# Altium project PCB_Project.PrjPcb (part 4 of 4)
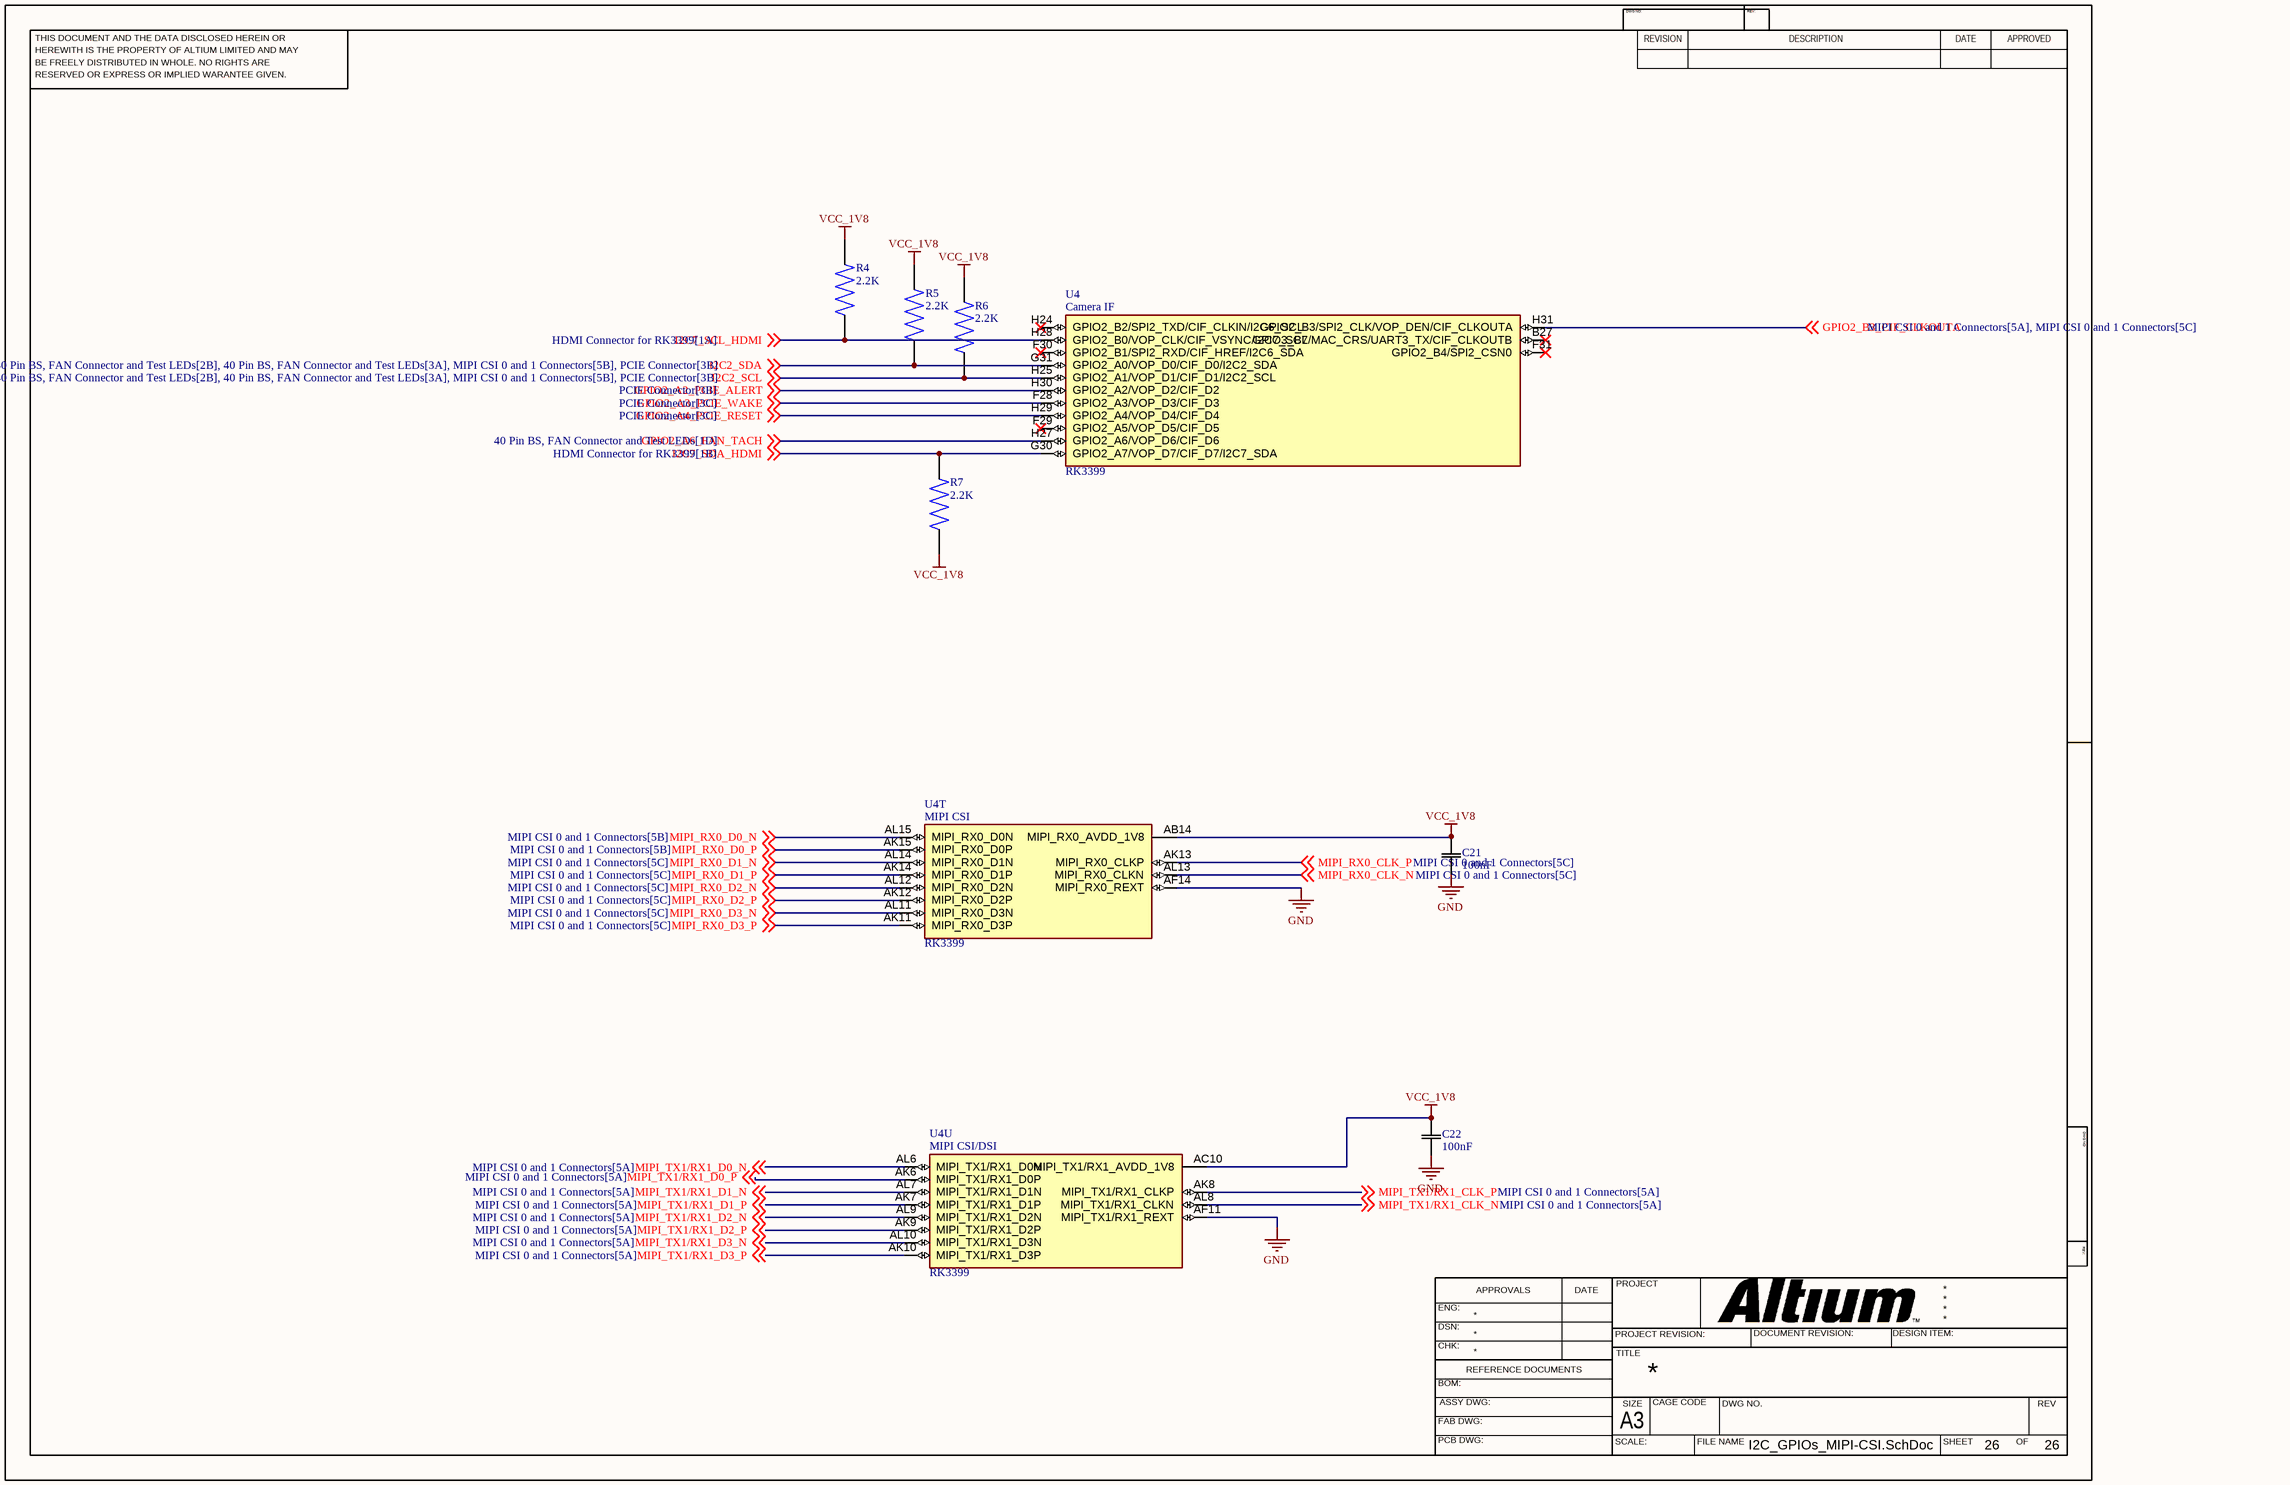
[diagram p26: I2C_GPIOs_MIPI-CSI.SchDoc]

## Nets that join several sheets
GND: USB2.0 (14 pins), TYPEC0 (24 pins), TYPEC (11 pins), System PMU for RK3399 (21 pins), SDMMC EMMC PCIE ADC Blocks (9 pins), RK3399 Side of LPDDR4 Controller (20 pins), Power Supply Page for RK3399 (214 pins), HDMI_MIPI-DSI_EDP (10 pins), HDMI Connector for RK3399 (14 pins), PMIC_Block_ (46 pins), LPDDR4 SDRAM_1 (77 pins), LPDDR4 SDRAM_2 (77 pins), EMMC with rk399 (10 pins), WIFI_MODULE (24 pins), SD Card and Debug Uart (18 pins), RGMII ETH PHY (B12.47 B12.49), RJ45 Connector and ESD Diodes (9 pins), Regulators and Buck Converters (28 pins), Power Supply for CPU Blocks (47 pins), MIPI CSI 0 and 1 Connectors (38 pins), EDP and MIPI DSI Connectors (21 pins), CODEC and Headphone Jack (20 pins), 40 Pin BS, FAN Connector and Test LEDs (16 pins), PCIE Connector (18 pins), I2C_GPIOs_MIPI-CSI (C21.1 C22.1 U4.AF11 U4.AF14)
VCC3V3_S3: EMMC with rk399 (5 pins), EDP and MIPI DSI Connectors (R93.1)
VCC3V3_S5: PMIC_Block_ (U7.51), Regulators and Buck Converters (C31.2 C224.2 U10.6 U11.6), Power Supply for CPU Blocks (Q4.2 Q4.3 R76.2)
VCC3V3_SYS: TYPEC0 (C13.2 U2.3 U2.4), System PMU for RK3399 (C12.1 U5.1), HDMI Connector for RK3399 (R38.2), WIFI_MODULE (B3.36 C205.2 C206.2 C218.2), SD Card and Debug Uart (C210.2 U9.1), Regulators and Buck Converters (C30.2 C241.1 C242.1 L6.2), Power Supply for CPU Blocks (20 pins), MIPI CSI 0 and 1 Connectors (8 pins), EDP and MIPI DSI Connectors (J11.17 J11.18), 40 Pin BS, FAN Connector and Test LEDs (C310.1 J14.1 J14.17), PCIE Connector (12 pins)
VCC5V0_HOST0: USB2.0 (8 pins), TYPEC0 (C32.2 U3.1)
VCC5V0_SYS: USB2.0 (C1.2 R1.2 U1.5), TYPEC0 (8 pins), HDMI Connector for RK3399 (F1.2 R35.2 R36.2), SD Card and Debug Uart (J7.2), Regulators and Buck Converters (C219.2 C251.1 C252.1 L7.2), MIPI CSI 0 and 1 Connectors (10 pins), EDP and MIPI DSI Connectors (J10.1 J10.2 J10.3), 40 Pin BS, FAN Connector and Test LEDs (C309.1 J14.2 J14.4)
VCC12V0_SYS: Regulators and Buck Converters (13 pins), EDP and MIPI DSI Connectors (J11.28 J11.29 J11.30), 40 Pin BS, FAN Connector and Test LEDs (R107.2)
VCC_0V9: TYPEC (10 pins), System PMU for RK3399 (6 pins), SDMMC EMMC PCIE ADC Blocks (C62.1 C64.1 U4.L24 U4.W24), RK3399 Side of LPDDR4 Controller (FL3.1 FL4.1), HDMI_MIPI-DSI_EDP (6 pins), Power Supply for CPU Blocks (C236.2 L10.2 R77.2)
VCC_1V8: TYPEC (6 pins), System PMU for RK3399 (23 pins), SDMMC EMMC PCIE ADC Blocks (C60.1 C66.1 U4.AC24 U4.K24), HDMI_MIPI-DSI_EDP (8 pins), EMMC with rk399 (5 pins), WIFI_MODULE (B3.34 C203.2 C204.2), Power Supply for CPU Blocks (5 pins), 40 Pin BS, FAN Connector and Test LEDs (J15.1 U21.3 U21.6), I2C_GPIOs_MIPI-CSI (8 pins)
VCC_3V0: RGMII_SDIO_I2S (8 pins), HDMI Connector for RK3399 (Q3.2 R37.2), PMIC_Block_ (C143.2 U7.15), SD Card and Debug Uart (R55.2 R56.2), CODEC and Headphone Jack (R104.2), 40 Pin BS, FAN Connector and Test LEDs (U21.7)
VCC_DDR: RK3399 Side of LPDDR4 Controller (46 pins), LPDDR4 SDRAM_1 (42 pins), LPDDR4 SDRAM_2 (42 pins)
VCC_DDRC: LPDDR4 SDRAM_1 (23 pins), LPDDR4 SDRAM_2 (23 pins)
VCC_LPDDR4_A: LPDDR4 SDRAM_1 (8 pins), LPDDR4 SDRAM_2 (8 pins)
VDD_GPU: Power Supply Page for RK3399 (30 pins), Power Supply for CPU Blocks (10 pins)
VDD_LOG: Power Supply Page for RK3399 (18 pins), Power Supply for CPU Blocks (C239.2 L11.2 R81.2)
ADC_IN0: SDMMC EMMC PCIE ADC Blocks (U4.AG26), 40 Pin BS, FAN Connector and Test LEDs (J16.2)
ADC_IN2: SDMMC EMMC PCIE ADC Blocks (U4.AG25), 40 Pin BS, FAN Connector and Test LEDs (J18.1)
ADC_IN3: SDMMC EMMC PCIE ADC Blocks (U4.AG28), 40 Pin BS, FAN Connector and Test LEDs (J18.2)
BT_REG_ON_H: System PMU for RK3399 (U4.V30), WIFI_MODULE (B3.38)
BT_WAKE_L: RGMII_SDIO_I2S (U4.AL4), WIFI_MODULE (B3.49)
CPU_B_SLEEP: RGMII_SDIO_I2S (U4.M27), Power Supply for CPU Blocks (U13.A1)
DDR0_A0: RK3399 Side of LPDDR4 Controller (U4.F2), LPDDR4 SDRAM_1 (B1.H2 B1.R2)
DDR0_A1: RK3399 Side of LPDDR4 Controller (U4.F1), LPDDR4 SDRAM_1 (B1.J2 B1.P2)
DDR0_A2: RK3399 Side of LPDDR4 Controller (U4.G1), LPDDR4 SDRAM_1 (B1.H9 B1.R9)
DDR0_A3: RK3399 Side of LPDDR4 Controller (U4.G2), LPDDR4 SDRAM_1 (B1.H10 B1.R10)
DDR0_A4: RK3399 Side of LPDDR4 Controller (U4.H2), LPDDR4 SDRAM_1 (B1.H11 B1.R11)
DDR0_A5: RK3399 Side of LPDDR4 Controller (U4.H1), LPDDR4 SDRAM_1 (B1.J11 B1.P11)
DDR0_CKE0: RK3399 Side of LPDDR4 Controller (U4.E1), LPDDR4 SDRAM_1 (B1.J4 B1.P4)
DDR0_CKE1: RK3399 Side of LPDDR4 Controller (U4.F5), LPDDR4 SDRAM_1 (B1.J5 B1.P5)
DDR0_CLK1_N: RK3399 Side of LPDDR4 Controller (U4.J5), LPDDR4 SDRAM_1 (B1.P9)
DDR0_CLK1_P: RK3399 Side of LPDDR4 Controller (U4.H5), LPDDR4 SDRAM_1 (B1.P8)
DDR0_CLK_N: RK3399 Side of LPDDR4 Controller (U4.J4), LPDDR4 SDRAM_1 (B1.J9)
DDR0_CLK_P: RK3399 Side of LPDDR4 Controller (U4.H4), LPDDR4 SDRAM_1 (B1.J8)
DDR0_CS0N: RK3399 Side of LPDDR4 Controller (U4.M6), LPDDR4 SDRAM_1 (B1.H4)
DDR0_CS1N: RK3399 Side of LPDDR4 Controller (U4.B1), LPDDR4 SDRAM_1 (B1.H3)
DDR0_CS2N: RK3399 Side of LPDDR4 Controller (U4.M5), LPDDR4 SDRAM_1 (B1.R4)
DDR0_CS3N: RK3399 Side of LPDDR4 Controller (U4.C2), LPDDR4 SDRAM_1 (B1.R3)
DDR0_D0: RK3399 Side of LPDDR4 Controller (U4.AB2), LPDDR4 SDRAM_1 (B1.B2)
DDR0_D1: RK3399 Side of LPDDR4 Controller (U4.AB1), LPDDR4 SDRAM_1 (B1.C2)
DDR0_D2: RK3399 Side of LPDDR4 Controller (U4.AA2), LPDDR4 SDRAM_1 (B1.E2)
DDR0_D3: RK3399 Side of LPDDR4 Controller (U4.AA1), LPDDR4 SDRAM_1 (B1.F2)
DDR0_D4: RK3399 Side of LPDDR4 Controller (U4.Y2), LPDDR4 SDRAM_1 (B1.F4)
DDR0_D5: RK3399 Side of LPDDR4 Controller (U4.Y1), LPDDR4 SDRAM_1 (B1.E4)
DDR0_D6: RK3399 Side of LPDDR4 Controller (U4.W1), LPDDR4 SDRAM_1 (B1.C4)
DDR0_D7: RK3399 Side of LPDDR4 Controller (U4.W2), LPDDR4 SDRAM_1 (B1.B4)
DDR0_D8: RK3399 Side of LPDDR4 Controller (U4.AF2), LPDDR4 SDRAM_1 (B1.B11)
DDR0_D9: RK3399 Side of LPDDR4 Controller (U4.AE2), LPDDR4 SDRAM_1 (B1.C11)
DDR0_D10: RK3399 Side of LPDDR4 Controller (U4.AF1), LPDDR4 SDRAM_1 (B1.E11)
DDR0_D11: RK3399 Side of LPDDR4 Controller (U4.AD2), LPDDR4 SDRAM_1 (B1.F11)
DDR0_D12: RK3399 Side of LPDDR4 Controller (U4.AE1), LPDDR4 SDRAM_1 (B1.F9)
DDR0_D13: RK3399 Side of LPDDR4 Controller (U4.AD1), LPDDR4 SDRAM_1 (B1.E9)
DDR0_D14: RK3399 Side of LPDDR4 Controller (U4.AC1), LPDDR4 SDRAM_1 (B1.C9)
DDR0_D15: RK3399 Side of LPDDR4 Controller (U4.AC2), LPDDR4 SDRAM_1 (B1.B9)
DDR0_D16: RK3399 Side of LPDDR4 Controller (U4.V1), LPDDR4 SDRAM_1 (B1.AA2)
DDR0_D17: RK3399 Side of LPDDR4 Controller (U4.V2), LPDDR4 SDRAM_1 (B1.AA4 B1.Y2)
DDR0_D18: RK3399 Side of LPDDR4 Controller (U4.U1), LPDDR4 SDRAM_1 (B1.U4 B1.V2)
DDR0_D19: RK3399 Side of LPDDR4 Controller (U4.U2), LPDDR4 SDRAM_1 (B1.U2)
DDR0_D21: RK3399 Side of LPDDR4 Controller (U4.T2), LPDDR4 SDRAM_1 (B1.V4)
DDR0_D22: RK3399 Side of LPDDR4 Controller (U4.R2), LPDDR4 SDRAM_1 (B1.Y4)
DDR0_D24: RK3399 Side of LPDDR4 Controller (U4.P1), LPDDR4 SDRAM_1 (B1.AA11)
DDR0_D25: RK3399 Side of LPDDR4 Controller (U4.P2), LPDDR4 SDRAM_1 (B1.Y11)
DDR0_D26: RK3399 Side of LPDDR4 Controller (U4.N1), LPDDR4 SDRAM_1 (B1.V11)
DDR0_D27: RK3399 Side of LPDDR4 Controller (U4.M1), LPDDR4 SDRAM_1 (B1.U11)
DDR0_D28: RK3399 Side of LPDDR4 Controller (U4.N2), LPDDR4 SDRAM_1 (B1.U9)
DDR0_D29: RK3399 Side of LPDDR4 Controller (U4.L1), LPDDR4 SDRAM_1 (B1.V9)
DDR0_D30: RK3399 Side of LPDDR4 Controller (U4.M2), LPDDR4 SDRAM_1 (B1.Y9)
DDR0_D31: RK3399 Side of LPDDR4 Controller (U4.L2), LPDDR4 SDRAM_1 (B1.AA9)
DDR0_DM0: RK3399 Side of LPDDR4 Controller (U4.Y5), LPDDR4 SDRAM_1 (B1.C3)
DDR0_DM1: RK3399 Side of LPDDR4 Controller (U4.AC5), LPDDR4 SDRAM_1 (B1.C10)
DDR0_DM2: RK3399 Side of LPDDR4 Controller (U4.U5), LPDDR4 SDRAM_1 (B1.Y3)
DDR0_DM3: RK3399 Side of LPDDR4 Controller (U4.P5), LPDDR4 SDRAM_1 (B1.Y10)
DDR0_DQS0_N: RK3399 Side of LPDDR4 Controller (U4.AA4), LPDDR4 SDRAM_1 (B1.E3)
DDR0_DQS0_P: RK3399 Side of LPDDR4 Controller (U4.Y4), LPDDR4 SDRAM_1 (B1.D3)
DDR0_DQS1_N: RK3399 Side of LPDDR4 Controller (U4.AD4), LPDDR4 SDRAM_1 (B1.E10)
DDR0_DQS1_P: RK3399 Side of LPDDR4 Controller (U4.AC4), LPDDR4 SDRAM_1 (B1.D10)
DDR0_DQS2_N: RK3399 Side of LPDDR4 Controller (U4.V4), LPDDR4 SDRAM_1 (B1.V3)
DDR0_DQS2_P: RK3399 Side of LPDDR4 Controller (U4.U4), LPDDR4 SDRAM_1 (B1.W3)
DDR0_DQS3_N: RK3399 Side of LPDDR4 Controller (U4.R4), LPDDR4 SDRAM_1 (B1.V10)
DDR0_DQS3_P: RK3399 Side of LPDDR4 Controller (U4.P4), LPDDR4 SDRAM_1 (B1.W10)
DDR0_RST: RK3399 Side of LPDDR4 Controller (U4.L7), LPDDR4 SDRAM_1 (B1.T11)
DDR1_A0: RK3399 Side of LPDDR4 Controller (U4.B10), LPDDR4 SDRAM_2 (B2.H2 B2.R2)
DDR1_A1: RK3399 Side of LPDDR4 Controller (U4.A10), LPDDR4 SDRAM_2 (B2.J2 B2.P2)
DDR1_A2: RK3399 Side of LPDDR4 Controller (U4.B9), LPDDR4 SDRAM_2 (B2.H9 B2.R9)
DDR1_A3: RK3399 Side of LPDDR4 Controller (U4.A9), LPDDR4 SDRAM_2 (B2.H10 B2.R10)
DDR1_A4: RK3399 Side of LPDDR4 Controller (U4.B8), LPDDR4 SDRAM_2 (B2.H11 B2.R11)
DDR1_A5: RK3399 Side of LPDDR4 Controller (U4.A8), LPDDR4 SDRAM_2 (B2.J11 B2.P11)
DDR1_CKE0: RK3399 Side of LPDDR4 Controller (U4.A5), LPDDR4 SDRAM_2 (B2.J4 B2.P4)
DDR1_CKE1: RK3399 Side of LPDDR4 Controller (U4.E6), LPDDR4 SDRAM_2 (B2.J5 B2.P5)
DDR1_CLK1_N: RK3399 Side of LPDDR4 Controller (U4.E8), LPDDR4 SDRAM_2 (B2.P9)
DDR1_CLK1_P: RK3399 Side of LPDDR4 Controller (U4.E9), LPDDR4 SDRAM_2 (B2.P8)
DDR1_CLK_N: RK3399 Side of LPDDR4 Controller (U4.D8), LPDDR4 SDRAM_2 (B2.J9)
DDR1_CLK_P: RK3399 Side of LPDDR4 Controller (U4.D9), LPDDR4 SDRAM_2 (B2.J8)
DDR1_CS0N: RK3399 Side of LPDDR4 Controller (U4.F12), LPDDR4 SDRAM_2 (B2.H4)
DDR1_CS1N: RK3399 Side of LPDDR4 Controller (U4.A2), LPDDR4 SDRAM_2 (B2.H3)
DDR1_CS2N: RK3399 Side of LPDDR4 Controller (U4.F11), LPDDR4 SDRAM_2 (B2.R4)
DDR1_CS3N: RK3399 Side of LPDDR4 Controller (U4.B3), LPDDR4 SDRAM_2 (B2.R3)
DDR1_D0: RK3399 Side of LPDDR4 Controller (U4.B15), LPDDR4 SDRAM_2 (B2.B2)
DDR1_D1: RK3399 Side of LPDDR4 Controller (U4.A15), LPDDR4 SDRAM_2 (B2.C2)
DDR1_D2: RK3399 Side of LPDDR4 Controller (U4.B16), LPDDR4 SDRAM_2 (B2.E2)
DDR1_D3: RK3399 Side of LPDDR4 Controller (U4.A16), LPDDR4 SDRAM_2 (B2.F2)
DDR1_D4: RK3399 Side of LPDDR4 Controller (U4.B17), LPDDR4 SDRAM_2 (B2.F4)
DDR1_D5: RK3399 Side of LPDDR4 Controller (U4.A17), LPDDR4 SDRAM_2 (B2.E4)
DDR1_D6: RK3399 Side of LPDDR4 Controller (U4.A18), LPDDR4 SDRAM_2 (B2.C4)
DDR1_D7: RK3399 Side of LPDDR4 Controller (U4.B18), LPDDR4 SDRAM_2 (B2.B4)
DDR1_D8: RK3399 Side of LPDDR4 Controller (U4.B11), LPDDR4 SDRAM_2 (B2.B11)
DDR1_D9: RK3399 Side of LPDDR4 Controller (U4.B12), LPDDR4 SDRAM_2 (B2.C11)
DDR1_D10: RK3399 Side of LPDDR4 Controller (U4.A11), LPDDR4 SDRAM_2 (B2.E11)
DDR1_D11: RK3399 Side of LPDDR4 Controller (U4.B13), LPDDR4 SDRAM_2 (B2.F11)
DDR1_D12: RK3399 Side of LPDDR4 Controller (U4.A12), LPDDR4 SDRAM_2 (B2.F9)
DDR1_D13: RK3399 Side of LPDDR4 Controller (U4.A13), LPDDR4 SDRAM_2 (B2.E9)
DDR1_D14: RK3399 Side of LPDDR4 Controller (U4.A14), LPDDR4 SDRAM_2 (B2.C9)
DDR1_D15: RK3399 Side of LPDDR4 Controller (U4.B14), LPDDR4 SDRAM_2 (B2.B9)
DDR1_D16: RK3399 Side of LPDDR4 Controller (U4.A19), LPDDR4 SDRAM_2 (B2.AA2)
DDR1_D17: RK3399 Side of LPDDR4 Controller (U4.B19), LPDDR4 SDRAM_2 (B2.AA4 B2.Y2)
DDR1_D18: RK3399 Side of LPDDR4 Controller (U4.A20), LPDDR4 SDRAM_2 (B2.U4 B2.V2)
DDR1_D19: RK3399 Side of LPDDR4 Controller (U4.B20), LPDDR4 SDRAM_2 (B2.U2)
DDR1_D21: RK3399 Side of LPDDR4 Controller (U4.B21), LPDDR4 SDRAM_2 (B2.V4)
DDR1_D22: RK3399 Side of LPDDR4 Controller (U4.B22), LPDDR4 SDRAM_2 (B2.Y4)
DDR1_D24: RK3399 Side of LPDDR4 Controller (U4.A23), LPDDR4 SDRAM_2 (B2.AA11)
DDR1_D25: RK3399 Side of LPDDR4 Controller (U4.B23), LPDDR4 SDRAM_2 (B2.Y11)
DDR1_D26: RK3399 Side of LPDDR4 Controller (U4.A24), LPDDR4 SDRAM_2 (B2.V11)
DDR1_D27: RK3399 Side of LPDDR4 Controller (U4.A25), LPDDR4 SDRAM_2 (B2.U11)
DDR1_D28: RK3399 Side of LPDDR4 Controller (U4.B24), LPDDR4 SDRAM_2 (B2.U9)
DDR1_D29: RK3399 Side of LPDDR4 Controller (U4.A26), LPDDR4 SDRAM_2 (B2.V9)
DDR1_D30: RK3399 Side of LPDDR4 Controller (U4.B25), LPDDR4 SDRAM_2 (B2.Y9)
DDR1_D31: RK3399 Side of LPDDR4 Controller (U4.B26), LPDDR4 SDRAM_2 (B2.AA9)
DDR1_DM0: RK3399 Side of LPDDR4 Controller (U4.E17), LPDDR4 SDRAM_2 (B2.C3)
DDR1_DM1: RK3399 Side of LPDDR4 Controller (U4.E14), LPDDR4 SDRAM_2 (B2.C10)
DDR1_DM2: RK3399 Side of LPDDR4 Controller (U4.E20), LPDDR4 SDRAM_2 (B2.Y3)
DDR1_DM3: RK3399 Side of LPDDR4 Controller (U4.E23), LPDDR4 SDRAM_2 (B2.Y10)
DDR1_DQS0_N: RK3399 Side of LPDDR4 Controller (U4.D17), LPDDR4 SDRAM_2 (B2.E3)
DDR1_DQS0_P: RK3399 Side of LPDDR4 Controller (U4.D18), LPDDR4 SDRAM_2 (B2.D3)
DDR1_DQS1_N: RK3399 Side of LPDDR4 Controller (U4.D14), LPDDR4 SDRAM_2 (B2.E10)
DDR1_DQS1_P: RK3399 Side of LPDDR4 Controller (U4.D15), LPDDR4 SDRAM_2 (B2.D10)
DDR1_DQS2_N: RK3399 Side of LPDDR4 Controller (U4.D20), LPDDR4 SDRAM_2 (B2.V3)
DDR1_DQS2_P: RK3399 Side of LPDDR4 Controller (U4.D21), LPDDR4 SDRAM_2 (B2.W3)
DDR1_DQS3_N: RK3399 Side of LPDDR4 Controller (U4.D23), LPDDR4 SDRAM_2 (B2.V10)
DDR1_DQS3_P: RK3399 Side of LPDDR4 Controller (U4.D24), LPDDR4 SDRAM_2 (B2.W10)
DDR1_RST: RK3399 Side of LPDDR4 Controller (U4.G11), LPDDR4 SDRAM_2 (B2.T11)
EDP_AUX_N: HDMI_MIPI-DSI_EDP (U4.A28), EDP and MIPI DSI Connectors (C258.1)
EDP_AUX_P: HDMI_MIPI-DSI_EDP (U4.B28), EDP and MIPI DSI Connectors (C257.1)
EDP_TX0_N: HDMI_MIPI-DSI_EDP (U4.A29), EDP and MIPI DSI Connectors (J11.11)
EDP_TX0_P: HDMI_MIPI-DSI_EDP (U4.B29), EDP and MIPI DSI Connectors (J11.12)
EDP_TX1_N: HDMI_MIPI-DSI_EDP (U4.A30), EDP and MIPI DSI Connectors (J11.8)
EDP_TX1_P: HDMI_MIPI-DSI_EDP (U4.B30), EDP and MIPI DSI Connectors (J11.9)
EDP_TX2_N: HDMI_MIPI-DSI_EDP (U4.C31), EDP and MIPI DSI Connectors (J11.5)
EDP_TX2_P: HDMI_MIPI-DSI_EDP (U4.C30), EDP and MIPI DSI Connectors (J11.6)
EDP_TX3_N: HDMI_MIPI-DSI_EDP (U4.D31), EDP and MIPI DSI Connectors (J11.2)
EDP_TX3_P: HDMI_MIPI-DSI_EDP (U4.D30), EDP and MIPI DSI Connectors (J11.3)
EMMC_D0: SDMMC EMMC PCIE ADC Blocks (U4.J28), EMMC with rk399 (U8.H4)
EMMC_D1: SDMMC EMMC PCIE ADC Blocks (U4.J29), EMMC with rk399 (U8.J4)
EMMC_D2: SDMMC EMMC PCIE ADC Blocks (U4.J30), EMMC with rk399 (U8.K4)
EMMC_D3: SDMMC EMMC PCIE ADC Blocks (U4.J25), EMMC with rk399 (U8.K5)
EMMC_D4: SDMMC EMMC PCIE ADC Blocks (U4.J26), EMMC with rk399 (U8.K6)
EMMC_D5: SDMMC EMMC PCIE ADC Blocks (U4.J27), EMMC with rk399 (U8.J7)
EMMC_D6: SDMMC EMMC PCIE ADC Blocks (U4.L31), EMMC with rk399 (U8.K7)
EMMC_D7: SDMMC EMMC PCIE ADC Blocks (U4.K30), EMMC with rk399 (U8.J8)
GPIO1_A0: RGMII_SDIO_I2S (U4.R25), 40 Pin BS, FAN Connector and Test LEDs (J14.7)
GPIO1_A1: RGMII_SDIO_I2S (U4.T31), 40 Pin BS, FAN Connector and Test LEDs (J14.11)
GPIO1_A3: RGMII_SDIO_I2S (U4.R27), 40 Pin BS, FAN Connector and Test LEDs (J14.13)
GPIO1_A4: RGMII_SDIO_I2S (U4.R28), 40 Pin BS, FAN Connector and Test LEDs (J14.15)
GPIO1_C2: RGMII_SDIO_I2S (U4.N31), 40 Pin BS, FAN Connector and Test LEDs (J14.12)
GPIO2_A2_PCIE_ALERT: PCIE Connector (J20.44), I2C_GPIOs_MIPI-CSI (U4.H30)
GPIO2_A3_PCIE_WAKE: PCIE Connector (J20.54), I2C_GPIOs_MIPI-CSI (U4.F28)
GPIO2_A4_PCIE_RESET: PCIE Connector (J20.50), I2C_GPIOs_MIPI-CSI (U4.H29)
GPIO2_A6_FAN_TACH: 40 Pin BS, FAN Connector and Test LEDs (D9.A R108.1), I2C_GPIOs_MIPI-CSI (U4.H27)
GPIO2_B3_CIF_CLKOUTA: MIPI CSI 0 and 1 Connectors (R90.1 R91.1), I2C_GPIOs_MIPI-CSI (U4.H31)
HDMI_CLK_N: HDMI_MIPI-DSI_EDP (U4.AL16), HDMI Connector for RK3399 (J4.12)
HDMI_CLK_P: HDMI_MIPI-DSI_EDP (U4.AK16), HDMI Connector for RK3399 (J4.10)
HDMI_TX0_N: HDMI_MIPI-DSI_EDP (U4.AL17), HDMI Connector for RK3399 (J4.9)
HDMI_TX0_P: HDMI_MIPI-DSI_EDP (U4.AK17), HDMI Connector for RK3399 (J4.7)
HDMI_TX1_N: HDMI_MIPI-DSI_EDP (U4.AL18), HDMI Connector for RK3399 (J4.6)
HDMI_TX1_P: HDMI_MIPI-DSI_EDP (U4.AK18), HDMI Connector for RK3399 (J4.4)
HDMI_TX2_N: HDMI_MIPI-DSI_EDP (U4.AL19), HDMI Connector for RK3399 (J4.3)
HDMI_TX2_P: HDMI_MIPI-DSI_EDP (U4.AK19), HDMI Connector for RK3399 (J4.1)
HOST0_D_N: USB2.0 (J1.2), TYPEC (U4.AB31)
HOST0_D_P: USB2.0 (J1.3), TYPEC (U4.AB30)
HOST1_D_N: USB2.0 (J2.2), TYPEC (U4.AA31)
HOST1_D_P: USB2.0 (J2.3), TYPEC (U4.AA30)
I2C1_SCL: RGMII_SDIO_I2S (R22.1 U4.Y6), MIPI CSI 0 and 1 Connectors (J9.9), CODEC and Headphone Jack (B13.35)
I2C1_SDA: RGMII_SDIO_I2S (R21.1 U4.AG1), MIPI CSI 0 and 1 Connectors (J9.10), CODEC and Headphone Jack (B13.36)
I2C2_SCL: MIPI CSI 0 and 1 Connectors (J8.9), 40 Pin BS, FAN Connector and Test LEDs (J14.28 U21.5), PCIE Connector (J20.40), I2C_GPIOs_MIPI-CSI (R6.1 U4.H25)
I2C2_SDA: MIPI CSI 0 and 1 Connectors (J8.10), 40 Pin BS, FAN Connector and Test LEDs (J14.27 U21.4), PCIE Connector (J20.42), I2C_GPIOs_MIPI-CSI (R5.1 U4.G31)
I2C4_SCL: TYPEC0 (U2.6), EDP and MIPI DSI Connectors (J10.6 J11.20)
I2C4_SDA: TYPEC0 (U2.7), EDP and MIPI DSI Connectors (J10.5 J11.19)
I2C7_SCL_HDMI: HDMI Connector for RK3399 (Q1.1), I2C_GPIOs_MIPI-CSI (R4.1 U4.H28)
I2C7_SDA_HDMI: HDMI Connector for RK3399 (Q2.1), I2C_GPIOs_MIPI-CSI (R7.2 U4.G30)
I2C_SCL_PMIC: RGMII_SDIO_I2S (R20.1 U4.N30), PMIC_Block_ (U7.19), Power Supply for CPU Blocks (U12.A3 U13.A3)
I2C_SDA_PMIC: RGMII_SDIO_I2S (R19.1 U4.M26), PMIC_Block_ (U7.18), Power Supply for CPU Blocks (U12.B1 U13.B1)
I2S0_LRCK_TX: RGMII_SDIO_I2S (U4.AJ2), CODEC and Headphone Jack (R97.1)
I2S0_SCLK: RGMII_SDIO_I2S (U4.AG3), CODEC and Headphone Jack (R96.1)
I2S1_LRCK_RX: RGMII_SDIO_I2S (U4.AA7), 40 Pin BS, FAN Connector and Test LEDs (J14.29)
I2S1_LRCK_TX: RGMII_SDIO_I2S (U4.AJ1), 40 Pin BS, FAN Connector and Test LEDs (J14.31)
I2S1_SCLK: RGMII_SDIO_I2S (U4.AF3), 40 Pin BS, FAN Connector and Test LEDs (J14.33)
I2S1_SDI0: RGMII_SDIO_I2S (U4.AD6), 40 Pin BS, FAN Connector and Test LEDs (J14.35)
I2S1_SDO0: RGMII_SDIO_I2S (U4.AC6), 40 Pin BS, FAN Connector and Test LEDs (J14.36)
I2S_CLK: RGMII_SDIO_I2S (U4.AC7), CODEC and Headphone Jack (R95.1), 40 Pin BS, FAN Connector and Test LEDs (J14.32)
MAC_MCLK: RGMII_SDIO_I2S (R18.1), RGMII ETH PHY (R59.1)
MAC_MDC: RGMII_SDIO_I2S (U4.E29), RGMII ETH PHY (B12.30)
MAC_MDIO: RGMII_SDIO_I2S (U4.G26), RGMII ETH PHY (B12.31)
MAC_RXCLK: RGMII_SDIO_I2S (U4.F25), RGMII ETH PHY (R61.2)
MAC_RXD0: RGMII_SDIO_I2S (U4.E26), RGMII ETH PHY (B12.14)
MAC_RXD1: RGMII_SDIO_I2S (U4.F27), RGMII ETH PHY (B12.16)
MAC_RXD2: RGMII_SDIO_I2S (U4.E30), RGMII ETH PHY (B12.17)
MAC_RXD3: RGMII_SDIO_I2S (U4.E25), RGMII ETH PHY (B12.18)
MAC_RXDV: RGMII_SDIO_I2S (U4.C27), RGMII ETH PHY (B12.13)
MAC_RXER: RGMII_SDIO_I2S (U4.F23), RGMII ETH PHY (B12.20)
MAC_TXCLK: RGMII_SDIO_I2S (R12.1), RGMII ETH PHY (R62.1)
MAC_TXD0: RGMII_SDIO_I2S (R13.1), RGMII ETH PHY (B12.23)
MAC_TXD1: RGMII_SDIO_I2S (R14.1), RGMII ETH PHY (B12.24)
MAC_TXD2: RGMII_SDIO_I2S (R15.1), RGMII ETH PHY (B12.25)
MAC_TXD3: RGMII_SDIO_I2S (R16.1), RGMII ETH PHY (B12.26)
MAC_TXEN: RGMII_SDIO_I2S (R17.1), RGMII ETH PHY (B12.27)
MIPI_CSI0_PWN: RGMII_SDIO_I2S (U4.AF8), MIPI CSI 0 and 1 Connectors (J9.12)
MIPI_CSI0_RST: RGMII_SDIO_I2S (U4.AD9), MIPI CSI 0 and 1 Connectors (J9.11)
MIPI_CSI_PWN: System PMU for RK3399 (U4.V26), MIPI CSI 0 and 1 Connectors (J8.12)
MIPI_RX0_CLK_N: MIPI CSI 0 and 1 Connectors (J9.26), I2C_GPIOs_MIPI-CSI (U4.AL13)
MIPI_RX0_CLK_P: MIPI CSI 0 and 1 Connectors (J9.25), I2C_GPIOs_MIPI-CSI (U4.AK13)
MIPI_RX0_D0_N: MIPI CSI 0 and 1 Connectors (J9.29), I2C_GPIOs_MIPI-CSI (U4.AL15)
MIPI_RX0_D0_P: MIPI CSI 0 and 1 Connectors (J9.28), I2C_GPIOs_MIPI-CSI (U4.AK15)
MIPI_RX0_D1_N: MIPI CSI 0 and 1 Connectors (J9.23), I2C_GPIOs_MIPI-CSI (U4.AL14)
MIPI_RX0_D1_P: MIPI CSI 0 and 1 Connectors (J9.22), I2C_GPIOs_MIPI-CSI (U4.AK14)
MIPI_RX0_D2_N: MIPI CSI 0 and 1 Connectors (J9.20), I2C_GPIOs_MIPI-CSI (U4.AL12)
MIPI_RX0_D2_P: MIPI CSI 0 and 1 Connectors (J9.19), I2C_GPIOs_MIPI-CSI (U4.AK12)
MIPI_RX0_D3_N: MIPI CSI 0 and 1 Connectors (J9.17), I2C_GPIOs_MIPI-CSI (U4.AL11)
MIPI_RX0_D3_P: MIPI CSI 0 and 1 Connectors (J9.16), I2C_GPIOs_MIPI-CSI (U4.AK11)
MIPI_TX0_CLK_N: HDMI_MIPI-DSI_EDP (U4.AH12), EDP and MIPI DSI Connectors (J10.28)
MIPI_TX0_CLK_P: HDMI_MIPI-DSI_EDP (U4.AG12), EDP and MIPI DSI Connectors (J10.29)
MIPI_TX0_D0_N: HDMI_MIPI-DSI_EDP (U4.AH15), EDP and MIPI DSI Connectors (J10.25)
MIPI_TX0_D0_P: HDMI_MIPI-DSI_EDP (U4.AG15), EDP and MIPI DSI Connectors (J10.26)
MIPI_TX0_D1_N: HDMI_MIPI-DSI_EDP (U4.AH14), EDP and MIPI DSI Connectors (J10.22)
MIPI_TX0_D1_P: HDMI_MIPI-DSI_EDP (U4.AG14), EDP and MIPI DSI Connectors (J10.23)
MIPI_TX0_D2_N: HDMI_MIPI-DSI_EDP (U4.AH11), EDP and MIPI DSI Connectors (J10.19)
MIPI_TX0_D2_P: HDMI_MIPI-DSI_EDP (U4.AG11), EDP and MIPI DSI Connectors (J10.20)
MIPI_TX0_D3_N: HDMI_MIPI-DSI_EDP (U4.AH9), EDP and MIPI DSI Connectors (J10.16)
MIPI_TX0_D3_P: HDMI_MIPI-DSI_EDP (U4.AG9), EDP and MIPI DSI Connectors (J10.17)
MIPI_TX1/RX1_CLK_N: MIPI CSI 0 and 1 Connectors (J8.26), I2C_GPIOs_MIPI-CSI (U4.AL8)
MIPI_TX1/RX1_CLK_P: MIPI CSI 0 and 1 Connectors (J8.25), I2C_GPIOs_MIPI-CSI (U4.AK8)
MIPI_TX1/RX1_D0_N: MIPI CSI 0 and 1 Connectors (J8.29), I2C_GPIOs_MIPI-CSI (U4.AL6)
MIPI_TX1/RX1_D0_P: MIPI CSI 0 and 1 Connectors (J8.28), I2C_GPIOs_MIPI-CSI (U4.AK6)
MIPI_TX1/RX1_D1_N: MIPI CSI 0 and 1 Connectors (J8.23), I2C_GPIOs_MIPI-CSI (U4.AL7)
MIPI_TX1/RX1_D1_P: MIPI CSI 0 and 1 Connectors (J8.22), I2C_GPIOs_MIPI-CSI (U4.AK7)
MIPI_TX1/RX1_D2_N: MIPI CSI 0 and 1 Connectors (J8.20), I2C_GPIOs_MIPI-CSI (U4.AL9)
MIPI_TX1/RX1_D2_P: MIPI CSI 0 and 1 Connectors (J8.19), I2C_GPIOs_MIPI-CSI (U4.AK9)
MIPI_TX1/RX1_D3_N: MIPI CSI 0 and 1 Connectors (J8.17), I2C_GPIOs_MIPI-CSI (U4.AL10)
MIPI_TX1/RX1_D3_P: MIPI CSI 0 and 1 Connectors (J8.16), I2C_GPIOs_MIPI-CSI (U4.AK10)
OffSheet: RGMII_SDIO_I2S (5 pins), EMMC with rk399 (U8.D5)
PCIE_REF_CLK_N: SDMMC EMMC PCIE ADC Blocks (U4.AD30), PCIE Connector (C298.2)
PCIE_REF_CLK_P: SDMMC EMMC PCIE ADC Blocks (U4.AD31), PCIE Connector (C297.2)
PCIE_RX0_N: SDMMC EMMC PCIE ADC Blocks (U4.AF31), PCIE Connector (C289.2)
PCIE_RX0_P: SDMMC EMMC PCIE ADC Blocks (U4.AF30), PCIE Connector (C290.2)
PCIE_RX1_N: SDMMC EMMC PCIE ADC Blocks (U4.AH31), PCIE Connector (C285.2)
PCIE_RX1_P: SDMMC EMMC PCIE ADC Blocks (U4.AH30), PCIE Connector (C286.2)
PCIE_RX2_N: SDMMC EMMC PCIE ADC Blocks (U4.AC28), PCIE Connector (J20.17)
PCIE_RX2_P: SDMMC EMMC PCIE ADC Blocks (U4.AC27), PCIE Connector (J20.19)
PCIE_RX3_N: SDMMC EMMC PCIE ADC Blocks (U4.AF28), PCIE Connector (J20.5)
PCIE_RX3_P: SDMMC EMMC PCIE ADC Blocks (U4.AF27), PCIE Connector (J20.7)
PCIE_TX0_N: SDMMC EMMC PCIE ADC Blocks (U4.AE31), PCIE Connector (C291.2)
PCIE_TX0_P: SDMMC EMMC PCIE ADC Blocks (U4.AE30), PCIE Connector (C293.2)
PCIE_TX1_N: SDMMC EMMC PCIE ADC Blocks (U4.AG31), PCIE Connector (C287.2)
PCIE_TX1_P: SDMMC EMMC PCIE ADC Blocks (U4.AG30), PCIE Connector (C288.2)
PCIE_TX2_N: SDMMC EMMC PCIE ADC Blocks (U4.AA28), PCIE Connector (C283.2)
PCIE_TX2_P: SDMMC EMMC PCIE ADC Blocks (U4.AA27), PCIE Connector (C284.2)
PCIE_TX3_N: SDMMC EMMC PCIE ADC Blocks (U4.AD28), PCIE Connector (C281.2)
PCIE_TX3_P: SDMMC EMMC PCIE ADC Blocks (U4.AD27), PCIE Connector (C282.2)
PORT_HPD: HDMI_MIPI-DSI_EDP (U4.AE15), HDMI Connector for RK3399 (D4.13 D4.14 J4.19)
RESET_L: System PMU for RK3399 (R11.1), PMIC_Block_ (U7.20)
RTC_CLK0_SOC: System PMU for RK3399 (U4.U31), PCIE Connector (J20.68)
SDIO0_CLK: RGMII_SDIO_I2S (U4.AF7), WIFI_MODULE (R52.2)
SDIO0_CMD: RGMII_SDIO_I2S (U4.AH6), WIFI_MODULE (B3.17)
SDIO0_D0: RGMII_SDIO_I2S (U4.AD8), WIFI_MODULE (B3.21)
SDIO0_D1: RGMII_SDIO_I2S (U4.AK5), WIFI_MODULE (B3.22)
SDIO0_D3: RGMII_SDIO_I2S (U4.AE8), WIFI_MODULE (B3.19)
SDMMC0_CLK: SDMMC EMMC PCIE ADC Blocks (U4.V29), SD Card and Debug Uart (R54.1)
SDMMC0_CMD: SDMMC EMMC PCIE ADC Blocks (U4.V25), SD Card and Debug Uart (B9.2 J6.3)
SDMMC0_D0: SDMMC EMMC PCIE ADC Blocks (U4.Y27), SD Card and Debug Uart (B8.2 J6.7)
SDMMC0_D1: SDMMC EMMC PCIE ADC Blocks (U4.Y26), SD Card and Debug Uart (B7.2 J6.8)
SDMMC0_D2: SDMMC EMMC PCIE ADC Blocks (U4.Y28), SD Card and Debug Uart (B5.2 J6.1)
SDMMC0_D3: SDMMC EMMC PCIE ADC Blocks (U4.U27), SD Card and Debug Uart (B4.2 J6.2)
SDMMC0_PWR_H: System PMU for RK3399 (U4.R29), SD Card and Debug Uart (U9.3)
SPI1_CLK: RGMII_SDIO_I2S (U4.P28), 40 Pin BS, FAN Connector and Test LEDs (J14.23)
SPI1_CSn0: RGMII_SDIO_I2S (U4.P29), 40 Pin BS, FAN Connector and Test LEDs (J14.24)
SPI1_RXD/UART4_RX: RGMII_SDIO_I2S (U4.P27), 40 Pin BS, FAN Connector and Test LEDs (J14.21)
SPI1_TXD/UART4_TX: RGMII_SDIO_I2S (U4.R31), 40 Pin BS, FAN Connector and Test LEDs (J14.19)
TYPEC0_D_N: TYPEC0 (J3.A7 J3.B7), TYPEC (U4.AH23)
TYPEC0_D_P: TYPEC0 (J3.A6 J3.B6), TYPEC (U4.AG23)
TYPEC0_RX1_N: TYPEC0 (J3.B10), TYPEC (U4.AL21)
TYPEC0_RX1_P: TYPEC0 (J3.B11), TYPEC (U4.AK21)
TYPEC0_RX2_N: TYPEC0 (J3.A10), TYPEC (U4.AL23)
TYPEC0_RX2_P: TYPEC0 (J3.A11), TYPEC (U4.AK23)
TYPEC0_SBU1: TYPEC0 (C9.2), TYPEC (U4.AK20)
TYPEC0_SBU2: TYPEC0 (C303.1), TYPEC (U4.AL20)
TYPEC0_TX1_N: TYPEC0 (C8.2), TYPEC (U4.AK22)
TYPEC0_TX1_P: TYPEC0 (C7.2), TYPEC (U4.AL22)
TYPEC0_TX2_N: TYPEC0 (C10.1), TYPEC (U4.AK24)
TYPEC0_TX2_P: TYPEC0 (C11.1), TYPEC (U4.AL24)
TYPEC0_U2VBUSDET: TYPEC0 (D1.C R3.1), TYPEC (U4.AK30)
UART0_CTS: RGMII_SDIO_I2S (U4.AG8), WIFI_MODULE (B3.42)
UART0_RTS: RGMII_SDIO_I2S (U4.AL5), WIFI_MODULE (B3.43)
UART0_RXD: RGMII_SDIO_I2S (U4.AE9), WIFI_MODULE (B3.40)
UART0_TXD: RGMII_SDIO_I2S (U4.AH8), WIFI_MODULE (B3.41)